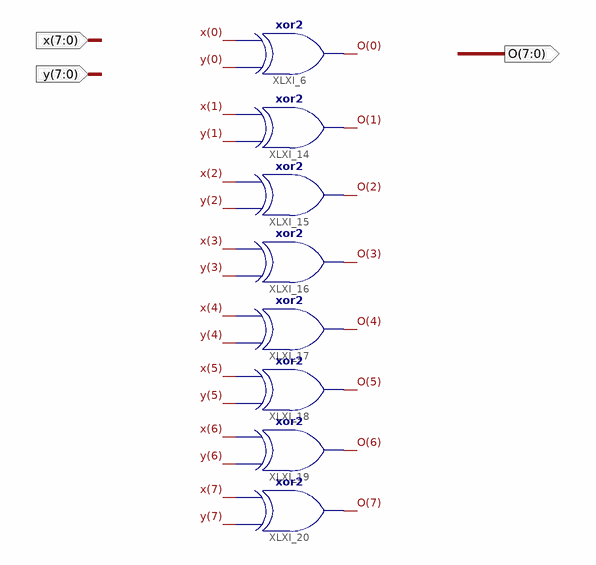
[diagram p0: schematic sheet 1]
// Xilinx ISE schematic xor_8bit.sch (spartan6) as structural Verilog: 8 symbols, 3 ports
module xor_8bit (
  input  [7:0] x,
  input  [7:0] y,
  output [7:0] O
);

  xor XLXI_6 (O[0], y[0], x[0]);
  xor XLXI_14 (O[1], y[1], x[1]);
  xor XLXI_15 (O[2], y[2], x[2]);
  xor XLXI_16 (O[3], y[3], x[3]);
  xor XLXI_17 (O[4], y[4], x[4]);
  xor XLXI_18 (O[5], y[5], x[5]);
  xor XLXI_19 (O[6], y[6], x[6]);
  xor XLXI_20 (O[7], y[7], x[7]);
endmodule
